# EAGLE schematic 6draft_onBoard (EAGLE 8.1.0)
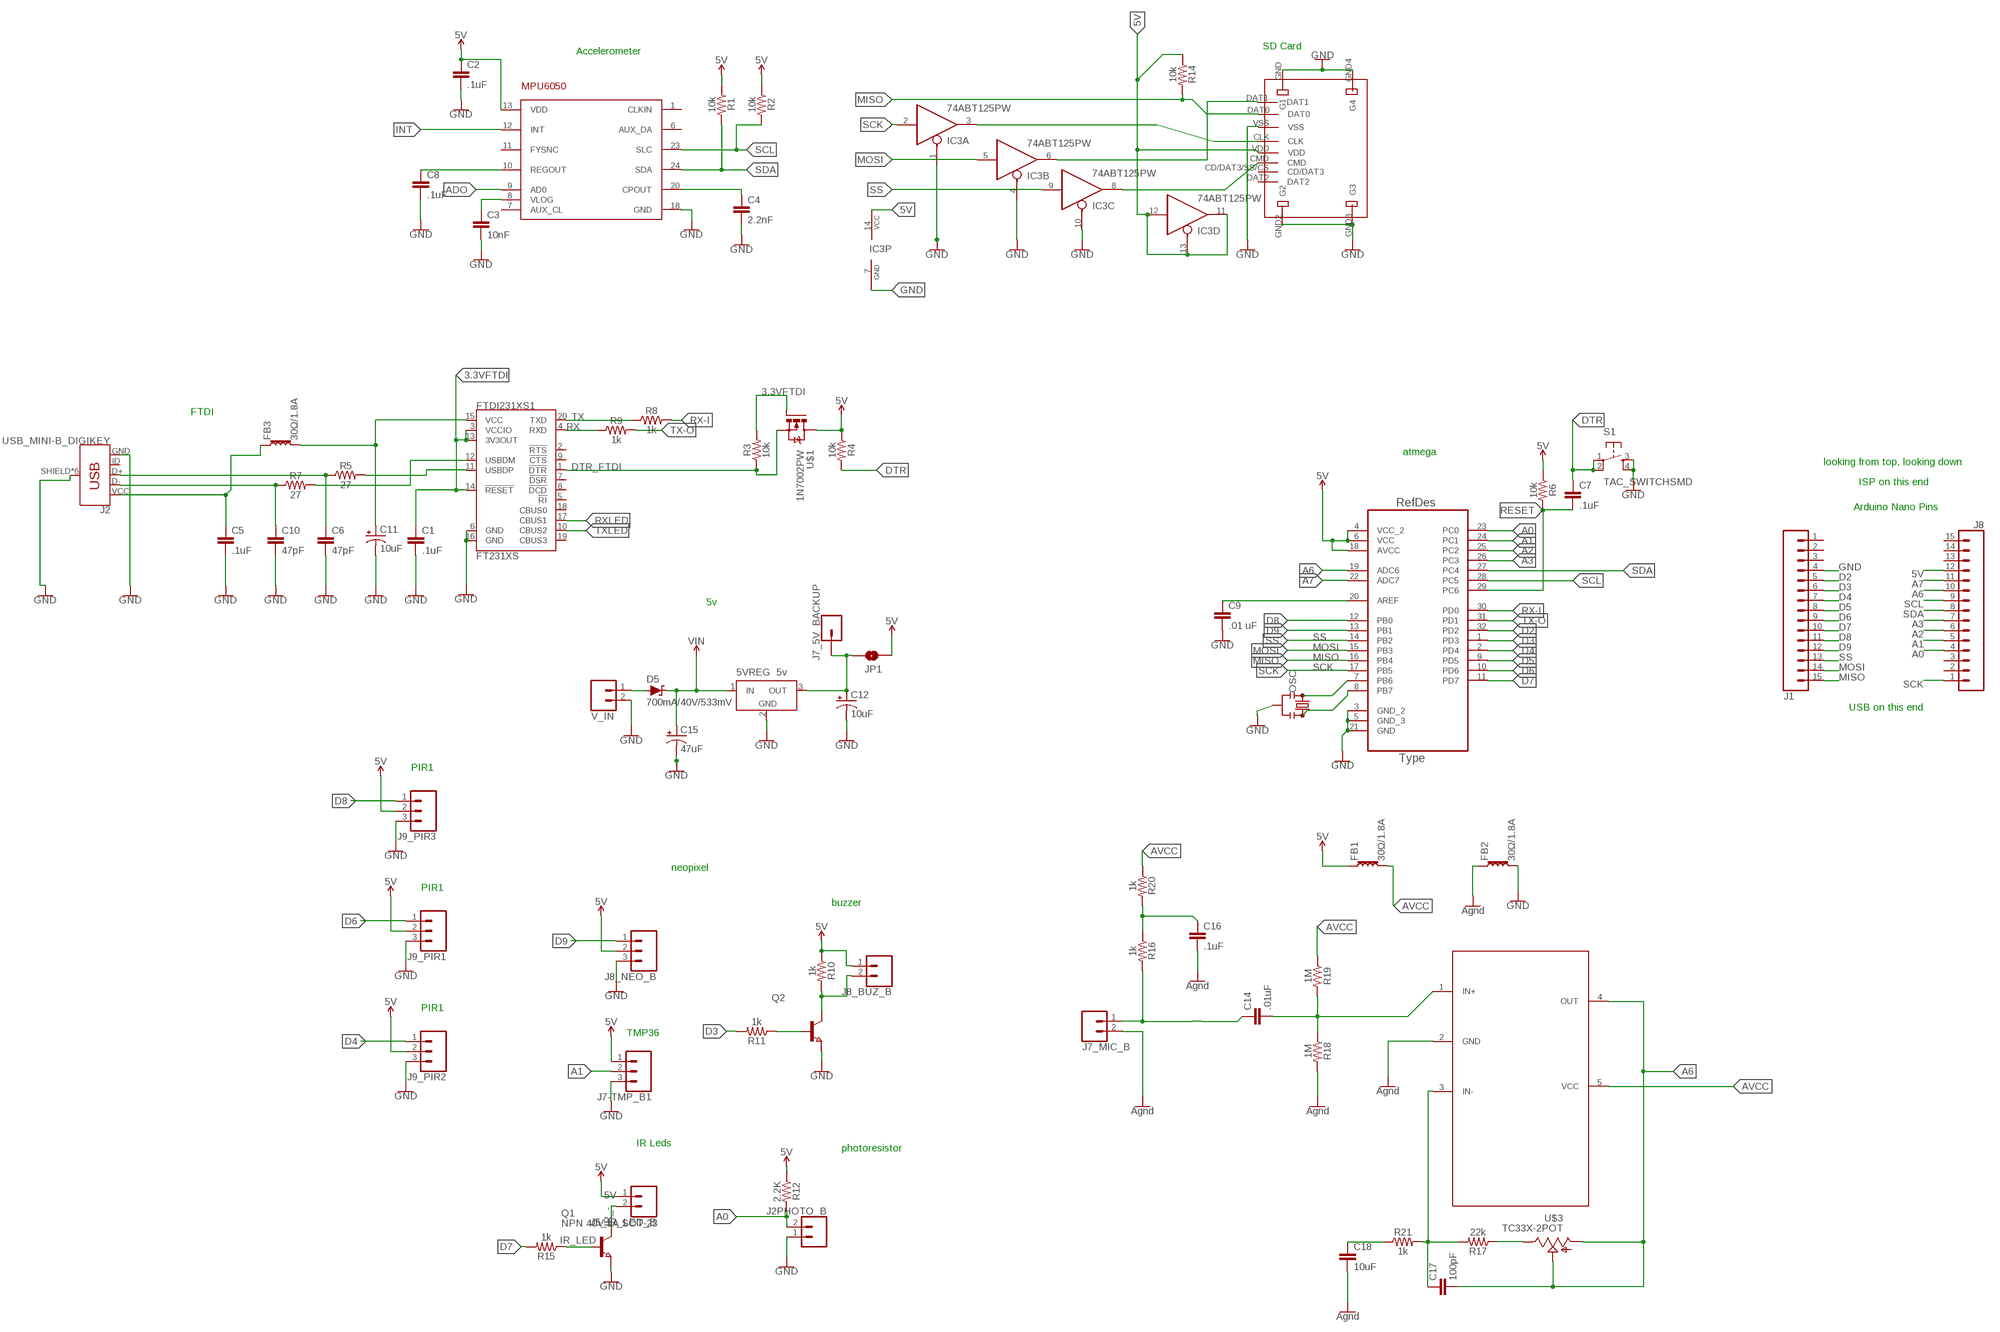
[diagram p0: schematic, sheet 1]

## Parts
5VREG  5v  LT1129CST5  [SOT223]
ATMEGA328P-AU  ATMEGA328P-AU  [QFP80P900X900X120-32N]
C1  .1uF  .22UF-CER  [0402-CAP]
C2  .1uF  .22UF-CER  [0402-CAP]
C3  10nF  .22UF-CER  [0402-CAP]
C4  2.2nF  .22UF-CER  [0402-CAP]
C5  .1uF  .22UF-CER  [0402-CAP]
C6  47pF  .22UF-CER  [0402-CAP]
C7  .1uF  .22UF-CER  [0402-CAP]
C8  .1uF  .22UF-CER  [0402-CAP]
C9  .01 uF  .22UF-CER  [0402-CAP]
C10  47pF  .22UF-CER  [0402-CAP]
C11  10uF  10UF-TANT  [EIA3216]
C12  10uF  10UF-TANT  [EIA3216]
C14  .01uF  .22UF-CER  [0402-CAP]
C15  47uF  10UF-TANT  [EIA3216]
C16  .1uF  .22UF-CER  [0402-CAP]
C17  100pF  .22UF-CER  [0402-CAP]
C18  10uF  .22UF-CER  [0402-CAP]
D5  700mA/40V/533mV  DIODE-SCHOTTKY-ZLLS500  [SOT23-3]
FB1  30Ω/1.8A  FERRITE_BEAD-0603  [0603]
FB2  30Ω/1.8A  FERRITE_BEAD-0603  [0603]
FB3  30Ω/1.8A  FERRITE_BEAD-0603  [0603]
FTDI231XS1  FT231XS  [SSOP20_L]
IC3  74ABT125PW  [TSSOP14]
IC4  MAX4466KS  [SC70-5]
J1  CONN_15  [1X15]
J2  USB_MINI-B_DIGIKEY  [MICRO-USB-DIGIKEY-FCI2]
J2PHOTO_B  CONN_02LOCK  [1X02_LOCK]
J5_IR_LED_B  CONN_02LOCK  [1X02_LOCK]
J7-TMP_B1  CONN_03  [1X03]
J7_5V_BACKUP  CONN_01  [1X01]
J7_MIC_B  CONN_02LOCK  [1X02_LOCK]
J8  CONN_15  [1X15]
J8_BUZ_B  CONN_02LOCK  [1X02_LOCK]
J8_NEO_B  CONN_03  [1X03]
J9_PIR1  CONN_03  [1X03]
J9_PIR2  CONN_03  [1X03]
J9_PIR3  CONN_03  [1X03]
JP1  JUMPER-SMT_2_NO_NO-SILK_ROUND  [SMT-JUMPER_2_NO_NO-SILK_ROUND]
MPU6050  MPU-6050  [QFN24-4X4]
OSC  RESONATORSMD-3.2X1.3  [RESONATOR-SMD-3.2X1.3]
Q1  NPN 40V 1A SOT-23  NPN-TRANSISTOR_SOT23  [SOT23]
Q2  NPN-TRANSISTOR_SOT23  [SOT23]
R1  10k  0.05OHM-0603-1/5W-1%  [0603]
R2  10k  0.05OHM-0603-1/5W-1%  [0603]
R3  10k  0.05OHM-0603-1/5W-1%  [0603]
R4  10k  0.05OHM-0603-1/5W-1%  [0603]
R5  27  0.05OHM-0603-1/5W-1%  [0603]
R6  10k  0.05OHM-0603-1/5W-1%  [0603]
R7  27  0.05OHM-0603-1/5W-1%  [0603]
R8  1k  0.05OHM-0603-1/5W-1%  [0603]
R9  1k  0.05OHM-0603-1/5W-1%  [0603]
R10  1k  0.05OHM-0603-1/5W-1%  [0603]
R11  1k  0.05OHM-0603-1/5W-1%  [0603]
R12  2.2K  0.05OHM-0603-1/5W-1%  [0603]
R14  10k  0.05OHM-0603-1/5W-1%  [0603]
R15  1k  0.05OHM-0603-1/5W-1%  [0603]
R16  1k  0.05OHM-0603-1/5W-1%  [0603]
R17  22k  0.05OHM-0603-1/5W-1%  [0603]
R18  1M  0.05OHM-0603-1/5W-1%  [0603]
R19  1M  0.05OHM-0603-1/5W-1%  [0603]
R20  1k  0.05OHM-0603-1/5W-1%  [0603]
R21  1k  0.05OHM-0603-1/5W-1%  [0603]
S1  TAC_SWITCHSMD  [TACTILE-SWITCH-SMD]
U$1  1N7002PW  [SOT323W_INFINEON]
U$2  WM6698TR-ND_MICROSD  [MICROSD2]
U$3  TC33X-2POT  [TC33X-2]
V_IN  CONN_02LOCK  [1X02_LOCK]

## Nets
2.2NF: C4.1 MPU6050.20(CPOUT)
3.3VFTDI: C1.1 FTDI231XS1.3(VCCIO) FTDI231XS1.13(3V3OUT) FTDI231XS1.14(!RESET) R3.2 U$1.1(G)
5REGOUT: 5VREG.3(OUT) C12.A(+) J7_5V_BACKUP.1 JP1.2
5V: ATMEGA328P-AU.4(VCC_2) ATMEGA328P-AU.6(VCC) ATMEGA328P-AU.18(AVCC) C2.1 FB1.1 IC3.11(D:O) IC3.12(D:I) IC3.13(D:OE) IC3.14(P:VCC) J5_IR_LED_B.1 J7-TMP_B1.1 J8.12 J8_BUZ_B.1 J8_NEO_B.2 J9_PIR1.2 J9_PIR2.2 J9_PIR3.2 JP1.1 MPU6050.13(VDD) R1.1 R2.1 R4.1 R6.1 R10.1 R12.1 R14.1 U$1.3(D) U$2.VDD
10NF: C3.1 MPU6050.8(VLOG)
.UF: C8.1 MPU6050.10(REGOUT)
A0: ATMEGA328P-AU.23(PC0) J2PHOTO_B.2 J8.4 R12.2
A1: ATMEGA328P-AU.24(PC1) J7-TMP_B1.2 J8.5
A2: ATMEGA328P-AU.25(PC2) J8.6
A3: ATMEGA328P-AU.26(PC3) J8.7
A6: ATMEGA328P-AU.19(ADC6) C17.2 IC4.4(OUT) J8.10 U$3.2 U$3.3
A7: ATMEGA328P-AU.22(ADC7) J8.11
ADO: MPU6050.9(AD0)
AVCC: FB1.2 IC4.5(VCC) R19.1 R20.1
BUZ-: J8_BUZ_B.2 Q2.3(C) R10.2
D2: ATMEGA328P-AU.32(PD2) J1.5
D3: ATMEGA328P-AU.1(PD3) J1.6 R11.2
D4: ATMEGA328P-AU.2(PD4) J1.7 J9_PIR2.1
D5: ATMEGA328P-AU.9(PD5) J1.8
D6: ATMEGA328P-AU.10(PD6) J1.9 J9_PIR1.1
D7: ATMEGA328P-AU.11(PD7) J1.10 R15.2
D8: ATMEGA328P-AU.12(PB0) J1.11 J9_PIR3.1
D9: ATMEGA328P-AU.13(PB1) J1.12 J8_NEO_B.1
DAT1: IC3.6(B:O) U$2.DAT1
DN+_P: C6.1 J2.D+ R5.1
DN_N: C10.1 J2.D- R7.1
DTR: C7.1 R4.2 S1.1 S1.2
DTR_FTDI: FTDI231XS1.1(!DTR) R3.1 U$1.2(S)
GND: 5VREG.2(GND) ATMEGA328P-AU.3(GND_2) ATMEGA328P-AU.5(GND_3) ATMEGA328P-AU.21(GND) C1.2 C2.2 C3.2 C4.2 C5.2 C6.2 C8.2 C9.2 C10.2 C11.C(-) C12.C(-) C15.C(-) C16.2 C18.2 FB2.1 FB2.2 FTDI231XS1.6(GND) FTDI231XS1.16(GND) IC3.1(A:OE) IC3.4(B:OE) IC3.7(P:GND) IC3.10(C:OE) IC4.2(GND) J1.4 J2.GND J2.SHIELD J2.SHIELD1(SHIELD) J2.SHIELD2(SHIELD) J2.SHIELD3(SHIELD) J2.SHIELD4(SHIELD) J2.SHIELD5(SHIELD) J2PHOTO_B.1 J7-TMP_B1.3 J7_MIC_B.2 J8_NEO_B.3 J9_PIR1.3 J9_PIR2.3 J9_PIR3.3 MPU6050.18(GND) OSC.2 Q1.2(E) Q2.2(E) R18.2 S1.3 S1.4 U$2.GND2(G2) U$2.GND3(G3) U$2.GND4(G4) U$2.GND(G1) U$2.VSS V_IN.2 ; supply symbol labelled Agnd
INT: MPU6050.12(INT)
IR_-: J5_IR_LED_B.2 Q1.3(C)
IR_LED: Q1.1(B) R15.1
MIC_IN+: C14.2 IC4.1(IN+) R18.1 R19.2
MIC_IN_C14: C14.1 J7_MIC_B.1 R16.2
MICNET1K: C16.1 R16.1 R20.2
MISO: ATMEGA328P-AU.16(PB4) J1.15 R14.2 U$2.DAT0
MOSI: ATMEGA328P-AU.15(PB3) IC3.5(B:I) J1.14
N$6: ATMEGA328P-AU.20(AREF) C9.1
N$12: R17.1 U$3.1
N$20: Q2.1(B) R11.1
N$22: D5.1(A) V_IN.1
N$29: C18.1 R21.1
N$30: C17.1 IC4.3(IN-) R17.2 R21.2
PB6: ATMEGA328P-AU.7(PB6) OSC.1
PB7: ATMEGA328P-AU.8(PB7) OSC.3
RESET: ATMEGA328P-AU.29(PC6) C7.2 R6.2
RX: FTDI231XS1.4(RXD) R9.1
RX-I: ATMEGA328P-AU.30(PD0) R8.2
RXLED: FTDI231XS1.17(CBUS1)
SCK: ATMEGA328P-AU.17(PB5) IC3.2(A:I) J8.1
SCK_BUFF: IC3.3(A:O) U$2.CLK
SCL: ATMEGA328P-AU.28(PC5) J8.9 MPU6050.23(SLC) R2.2
SDA: ATMEGA328P-AU.27(PC4) J8.8 MPU6050.24(SDA) R1.2
SS: ATMEGA328P-AU.14(PB2) IC3.9(C:I) J1.13
SS_BUFF: IC3.8(C:O) U$2.CMD
TX: FTDI231XS1.20(TXD) R8.1
TX-O: ATMEGA328P-AU.31(PD1) R9.2
TXLED: FTDI231XS1.10(CBUS2)
USBD_M: FTDI231XS1.12(USBDM) R7.2
USBD_P: FTDI231XS1.11(USBDP) R5.2
VIN: 5VREG.1(IN) C15.A(+) D5.3(C)
VUSB: C5.1 C11.A(+) FB3.1 FB3.2 FTDI231XS1.15(VCC) J2.VCC(VBUS)
Unconnected: FTDI231XS1.2(!RTS) FTDI231XS1.5(!RI) FTDI231XS1.7(!DSR) FTDI231XS1.8(!DCD) FTDI231XS1.9(!CTS) FTDI231XS1.18(CBUS0) FTDI231XS1.19(CBUS3) J1.1 J1.2 J1.3 J2.ID J8.2 J8.3 J8.13 J8.14 J8.15 MPU6050.1(CLKIN) MPU6050.6(AUX_DA) MPU6050.7(AUX_CL) MPU6050.11(FYSNC) U$2.CD/DAT3/SS/CS(CD/DAT3) U$2.DAT2

## Notes on the sheet
- SD Card
- Accelerometer
- FTDI
- atmega
- looking from top, looking down
- ISP on this end
- Arduino Nano Pins
- 5v
- USB on this end
- PIR1
- neopixel
- PIR1
- buzzer
- PIR1
- TMP36
- IR Leds
- photoresistor

## Power pins joined to a net without a drawn wire
GND: 5VREG.4(GND)

## Library data of the parts
5VREG = linear-technology:LT1129CST5: VOLTAGE REGULATOR with shutdown; MPN: LT1129CST-5#PBF; OC_FARNELL: 1663375; OC_NEWARK: 57M2069
ATMEGA328P-AU = Atmega-328pu:ATMEGA328P-AU; DESCRIPTION: 8-bit Microcontroller with In-System Programmable Flash; MPN: ATMEGA328P-AU; OC_FARNELL: 1715486; OC_NEWARK: 14R4631; PACKAGE: TQFP-32; SUPPLIER: Atmel
C1-C10 C14 C16-C18 = SparkFun-Retired:.22UF-CER: .22uF ceramic SMT CAP-09885- 50V +80%/-20% (0603); PROD_ID: CAP-09885; VALUE: .22uF
C11 C12 = SparkFun-Retired:10UF-TANT: 10uF Tantalum SMT CAP-00811- 16V 10% (EIA-3216); PROD_ID: CAP-00811
C15 = SparkFun-Retired:10UF-TANT: 10uF Tantalum SMT CAP-00811- 16V 10% (EIA-3216); PROD_ID: CAP-00811; VALUE: 10uF
D5 = SparkFun-DiscreteSemi:DIODE-SCHOTTKY: Schottky diode A Schottky diode is a semiconductor diode which has a low forward voltage drop and a very fast switching action.; PROD_ID: DIO-08411
FB1-FB3 = SparkFun-Coils:FERRITE_BEAD: Ferrite Bead (blocks, cores, rings, chokes, etc.) Inductor with layers of ferrite used to suppress high frequencies. Often used to isolate high frequency noise. SparkFun Products: IOIO-OTG - V2.2 <https://www.sparkfun.com/products/13613> SparkFun SAMD21 Mini Breakout <https://www.sparkfun.com/products/13664> SparkFun 6 Degrees of Freedom Breakout - LSM6DS3 <https://www.sparkfun.com/products/13339> SparkFun SAMD21 Dev Breakout <https://www.sparkfun.com/products/13672>; PROD_ID: NDUC-07859
FTDI231XS1 = SparkFun-IC-Comms:FT231X: FTDI FT231X Full Speed USB to Full-handshake UART This USB2.0 Full Speed IC offers a compact bridge to full handshake UART interfaces. The device is a UART, capable of operating up to 3MBaud, with low power consumption (8mA). The FT231X includes the complete FT-X series feature set and enables USB to be added into a system design quickly and easily over a UART interface. Datasheet <http://cdn.sparkfun.com/datasheets/Components/General%20IC/DS_FT231X.pdf> SparkFun Products SparkFun RedBoard - Programmed with Arduino <https://www.sparkfun.com/products/12757> (DEV-12757) SparkFun XBee Explorer USB <https://www.sparkfun.com/products/11812> (WRL-11812) SparkFun XBee Explorer Dongle <https://www.sparkfun.com/products/11697> (WRL-11697) SparkFun Blynk Board - ESP8266 <https://www.sparkfun.com/products/13794> (WRL-13794) SparkFun ESP8266 Thing - Dev Board <https://www.sparkfun.com/products/13711> (WRL-13711) SparkFun Block for Intel® Edison - Base <https://www.sparkfun.com/products/13045> (DEV-13045) SparkFun RedStick <https://www.sparkfun.com/products/13741> (DEV-13741) SparkFun Beefy 3 - FTDI Basic Breakout <https://www.sparkfun.com/products/13746> (DEV-13746) SparkFun FT231X Breakout <https://www.sparkfun.com/products/11736> (BOB-11736); PROD_ID: IC-11524
IC3 = 74xx-us:74*125: Quad bus BUFFER, 3-state
IC4 = KevinKuwata1:MAX4466: MAX4466 SOT23 SC70 mic amp arduino adafruit sparkfun
J1 J8 = SparkFun-Connectors:CONN_15: Multi connection point. Often used as Generic Header-pin footprint for 0.1 inch spaced/style header connections On any of the 0.1 inch spaced packages, you can populate with these: Break Away Headers - Straight <https://www.sparkfun.com/products/116> (PRT-00116) Break Away Male Headers - Right Angle <https://www.sparkfun.com/products/553> (PRT-00553) Female Headers <https://www.sparkfun.com/products/115> (PRT-00115) Break Away Headers - Machine Pin <https://www.sparkfun.com/products/117> (PRT-00117) Break Away Female Headers - Swiss Machine Pin <https://www.sparkfun.com/products/743> (PRT-00743) For SCREWTERMINALS and SPRING TERMINALS visit here: Screw Terimnals on SparkFun.com <https://www.sparkfun.com/search/results?term=Screw+Terminals> (5mm/3.5mm/2.54mm spacing) This device is also useful as a general connection point to wire up your design to another part of your project. Our various solder wires solder well into these plated through hole pads. Hook-Up Wire - Assortment (Stranded, 22 AWG) <https://www.sparkfun.com/products/11375> (PRT-11375) Hook-Up Wire - Assortment (Solid Core, 22 AWG) <https://www.sparkfun.com/products/11367> (PRT-11367) View the entire wire category on our website here <https://www.sparkfun.com/categories/141> Special notes: Molex polarized connector foot print use with SKU : PRT-08231 with associated crimp pins and housings. 1MM SMD Version SKU: PRT-10208 NOTES ON THE VARIANTS LOCK and LOCK_LONGPADS... This footprint was designed to help hold the alignment of a through-hole component (i.e. 6-pin header) while soldering it into place. You may notice that each hole has been shifted either up or down by 0.005 of an inch from it's more standard position (which is a perfectly straight line). This slight alteration caused the pins (the squares in the middle) to touch the edges of the holes. Because they are alternating, it causes a "brace" to hold the component in place. 0.005 has proven to be the perfect amount of "off-center" position when using our standard breakaway headers. Although looks a little odd when you look at the bare footprint, once you have a header in there, the alteration is very hard to notice. Also,if you push a header all the way into place, it is covered up entirely on the bottom side.
J2 = KevinKuwata1:USB_MINI-B_DIGIKEY: USB type Mini-B Connector Breaks out 5th pin, and includes shield pins if needed. SparkFun Products: SparkFun FTDI Basic Breakout <https://www.sparkfun.com/products/9716> SparkFun XBee Explorer USB <https://www.sparkfun.com/products/11812> SparkFun Redboard <https://www.sparkfun.com/products/12757>
J2PHOTO_B J5_IR_LED_B J7_MIC_B J8_BUZ_B V_IN = SparkFun-Connectors:CONN_02: Multi connection point. Often used as Generic Header-pin footprint for 0.1 inch spaced/style header connections On any of the 0.1 inch spaced packages, you can populate with these: Break Away Headers - Straight <https://www.sparkfun.com/products/116> (PRT-00116) Break Away Male Headers - Right Angle <https://www.sparkfun.com/products/553> (PRT-00553) Female Headers <https://www.sparkfun.com/products/115> (PRT-00115) Break Away Headers - Machine Pin <https://www.sparkfun.com/products/117> (PRT-00117) Break Away Female Headers - Swiss Machine Pin <https://www.sparkfun.com/products/743> (PRT-00743) For SCREWTERMINALS and SPRING TERMINALS visit here: Screw Terimnals on SparkFun.com <https://www.sparkfun.com/search/results?term=Screw+Terminals> (5mm/3.5mm/2.54mm spacing) This device is also useful as a general connection point to wire up your design to another part of your project. Our various solder wires solder well into these plated through hole pads. Hook-Up Wire - Assortment (Stranded, 22 AWG) <https://www.sparkfun.com/products/11375> (PRT-11375) Hook-Up Wire - Assortment (Solid Core, 22 AWG) <https://www.sparkfun.com/products/11367> (PRT-11367) View the entire wire category on our website here <https://www.sparkfun.com/categories/141> Special notes: Molex polarized connector foot print use with: PRT-08233 with associated crimp pins and housings. 2.54_SCREWTERM for use with PRT-10571. 3.5mm Screw Terminal footprints for PRT-08084 5mm Screw Terminal footprints for use with PRT-08432
J7-TMP_B1 J8_NEO_B J9_PIR1-J9_PIR3 = SparkFun-Connectors:CONN_03: Multi connection point. Often used as Generic Header-pin footprint for 0.1 inch spaced/style header connections On any of the 0.1 inch spaced packages, you can populate with these: Break Away Headers - Straight <https://www.sparkfun.com/products/116> (PRT-00116) Break Away Male Headers - Right Angle <https://www.sparkfun.com/products/553> (PRT-00553) Female Headers <https://www.sparkfun.com/products/115> (PRT-00115) Break Away Headers - Machine Pin <https://www.sparkfun.com/products/117> (PRT-00117) Break Away Female Headers - Swiss Machine Pin <https://www.sparkfun.com/products/743> (PRT-00743) Stackable Header - 3 Pin (Female, 0.1") <https://www.sparkfun.com/products/13875> (PRT-13875) For SCREWTERMINALS and SPRING TERMINALS visit here: Screw Terimnals on SparkFun.com <https://www.sparkfun.com/search/results?term=Screw+Terminals> (5mm/3.5mm/2.54mm spacing) This device is also useful as a general connection point to wire up your design to another part of your project. Our various solder wires solder well into these plated through hole pads. Hook-Up Wire - Assortment (Stranded, 22 AWG) <https://www.sparkfun.com/products/11375> (PRT-11375) Hook-Up Wire - Assortment (Solid Core, 22 AWG) <https://www.sparkfun.com/products/11367> (PRT-11367) View the entire wire category on our website here <https://www.sparkfun.com/categories/141> Special notes: Molex polarized connector foot print use with SKU : PRT-08232 with associated crimp pins and housings.
J7_5V_BACKUP = SparkFun-Connectors:CONN_01: Single connection point. Often used as Generic Header-pin footprint for 0.1 inch spaced/style header connections On any of the 0.1 inch spaced packages, you can populate with these: Break Away Headers - Straight <https://www.sparkfun.com/products/116> (PRT-00116) Break Away Male Headers - Right Angle <https://www.sparkfun.com/products/553> (PRT-00553) Female Headers <https://www.sparkfun.com/products/115> (PRT-00115) Break Away Headers - Machine Pin <https://www.sparkfun.com/products/117> (PRT-00117) Break Away Female Headers - Swiss Machine Pin <https://www.sparkfun.com/products/743> (PRT-00743) This device is also useful as a general connection point to wire up your design to another part of your project. Our various solder wires solder well into these plated through hole pads. Hook-Up Wire - Assortment (Stranded, 22 AWG) <https://www.sparkfun.com/products/11375> (PRT-11375) Hook-Up Wire - Assortment (Solid Core, 22 AWG) <https://www.sparkfun.com/products/11367> (PRT-11367) View the entire wire category on our website here <https://www.sparkfun.com/categories/141> Special notes: SMTSO-256-ET is a "flush mount" nut for a 4-40 screw. We mostly use this on specialty testbeds; it is a nice way to connect hardware to your PCB at an adjustable hieght. Also note, the SNAP packages are for using a snappable style connector. We sell a baggie of snaps and they are also used on two LilyPad designs: Snap Assortment - 30 pack (male and female) <https://www.sparkfun.com/products/11347> (DEV-11347) LilyPad Arduino SimpleSnap <https://www.sparkfun.com/products/10941> (DEV-10941) LilyPad SimpleSnap Protoboard <https://www.sparkfun.com/products/10940> (DEV-10940)
JP1 = SparkFun-Jumpers:JUMPER-SMT_2_NO: Normally open jumper This jumper has two pads in close proximity to each other. Apply solder to close the connection. Round pads are easier to solder for beginners, but are a lot larger. SparkFun Product that uses the round pads: SparkFun EL Sequencer <https://www.sparkfun.com/products/12781>
MPU6050 = KevinKuwata1:MPU-6050
OSC = SparkFun-Clocks:RESONATOR: Resonators (Generic) Ceramic resonators are clock-generating components, often used to control timing in microcontrollers. They usually have 3 pins: two pins for oscillation, and one pin for ground. Compared to crystals, resonators have worse tolerance, but are usually much cheaper. Plus, they have built-in load capacitors! These devices are used on boards like the Arduino Pro 8MHz <https://www.sparkfun.com/products/11114> and Arduino Pro 16MHz <https://www.sparkfun.com/products/11113>.
Q1 Q2 = semicon-smd-ipc:NPN-TRANSISTOR_: NPN TRANSISTOR
R1-R12 R14-R21 = SparkFun-Resistors:0.05OHM: 0.05Ω resistor A resistor is a passive two-terminal electrical component that implements electrical resistance as a circuit element. Resistors act to reduce current flow, and, at the same time, act to lower voltage levels within circuits. - Wikipedia; PROD_ID: RES-12535; VALUE: 0.05
S1 = SparkFun-Retired:TAC_SWITCH: Momentary Switch Button commonly used for reset or general input. Spark Fun Electronics SKU : COM-00097 SMT- SWCH-08247; PROD_ID: SWCH-08247
U$1 = KevinKuwata1:1N7002PW
U$2 = KevinKuwata1:WM6698TR-ND_MICROSD
U$3 = KevinKuwata1:TC33X-2POT

## Net classes
0 default: clearance 0.051 mm